# EAGLE design RoverBaseboard (EAGLE 6.4)
DATABASE: /home/mes/eagle/PARTSDB.txt
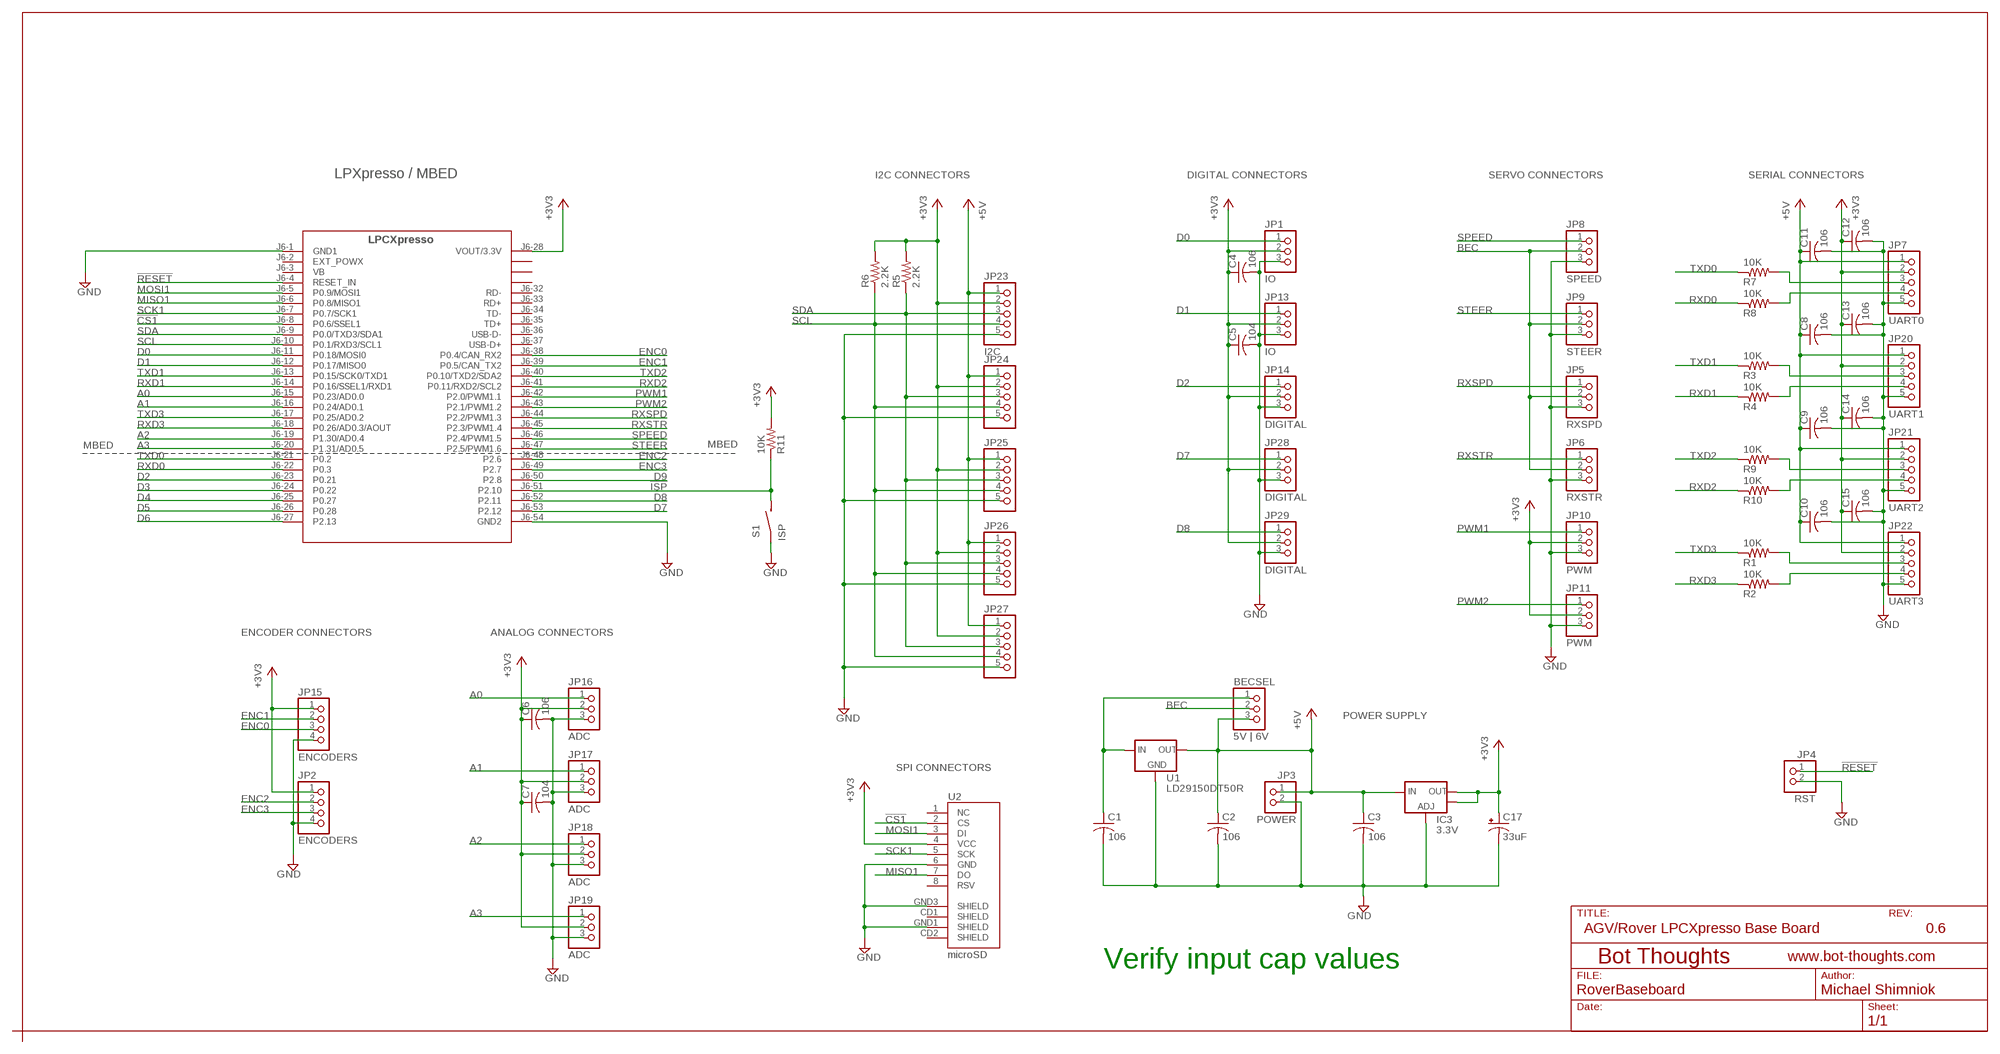
[diagram p0: schematic, sheet 1]

## Parts
BECSEL  5V | 6V  PINHD-1X03_2.54-S  [1X03-S]
C1  106  C-USC1206  [C1206]
C2  106  C-USC1206  [C1206]
C3  106  C-USC1206  [C1206]
C4  106  C-USC0603  [C0603]
C5  104  C-USC0603  [C0603]
C6  106  C-USC0603  [C0603]
C7  104  C-USC0603  [C0603]
C8  106  C-USC0603  [C0603]
C9  106  C-USC0603  [C0603]
C10  106  C-USC0603  [C0603]
C11  106  C-USC0603  [C0603]
C12  106  C-USC0603  [C0603]
C13  106  C-USC0603  [C0603]
C14  106  C-USC0603  [C0603]
C15  106  C-USC0603  [C0603]
C17  33uF  CPOL-US140CLH-0810  [140CLH-0810]
IC3  3.3V  V_REG_LM1117SOT223  [SOT223]
JP1  IO  PINHD-1X03_2.54-S  [1X03-S]
JP2  ENCODERS  PINHD-1X04_2.54-S  [1X04-S]
JP3  POWER  PINHD-1X02_2.54-S  [1X02-S]
JP4  RST  PINHD-1X02_2.54-S  [1X02-S]
JP5  RXSPD  PINHD-1X03_2.54-S  [1X03-S]
JP6  RXSTR  PINHD-1X03_2.54-S  [1X03-S]
JP7  UART0  PINHD-1X05_2.54-S  [1X05-S]
JP8  SPEED  PINHD-1X03_2.54-S  [1X03-S]
JP9  STEER  PINHD-1X03_2.54-S  [1X03-S]
JP10  PWM  PINHD-1X03_2.54-S  [1X03-S]
JP11  PWM  PINHD-1X03_2.54-S  [1X03-S]
JP13  IO  PINHD-1X03_2.54-S  [1X03-S]
JP14  DIGITAL  PINHD-1X03_2.54-S  [1X03-S]
JP15  ENCODERS  PINHD-1X04_2.54-S  [1X04-S]
JP16  ADC  PINHD-1X03_2.54-S  [1X03-S]
JP17  ADC  PINHD-1X03_2.54-S  [1X03-S]
JP18  ADC  PINHD-1X03_2.54-S  [1X03-S]
JP19  ADC  PINHD-1X03_2.54-S  [1X03-S]
JP20  UART1  PINHD-1X05_2.54-S  [1X05-S]
JP21  UART2  PINHD-1X05_2.54-S  [1X05-S]
JP22  UART3  PINHD-1X05_2.54-S  [1X05-S]
JP23  I2C  PINHD-1X05_2.54-S  [1X05-S]
JP24  PINHD-1X05_2.54-S  [1X05-S]
JP25  PINHD-1X05_2.54-S  [1X05-S]
JP26  PINHD-1X05_2.54-S  [1X05-S]
JP27  PINHD-1X05_2.54-S  [1X05-S]
JP28  DIGITAL  PINHD-1X03_2.54-S  [1X03-S]
JP29  DIGITAL  PINHD-1X03_2.54-S  [1X03-S]
R1  10K  R-US_R0603  [R0603]
R2  10K  R-US_R0603  [R0603]
R3  10K  R-US_R0603  [R0603]
R4  10K  R-US_R0603  [R0603]
R5  2.2K  R-US_R0603  [R0603]
R6  2.2K  R-US_R0603  [R0603]
R7  10K  R-US_R0603  [R0603]
R8  10K  R-US_R0603  [R0603]
R9  10K  R-US_R0603  [R0603]
R10  10K  R-US_R0603  [R0603]
R11  10K  R-US_R0603  [R0603]
S1  ISP  SPST_TAC_RECT1  [6MMTACTILE_RECT]
U1  LD29150DT50R  LD29150DT  [DPAK]
U2  microSD  USD-SOCKETNEW  [MICRO-SD-SOCKET-PP]
U$1  LPCXPRESSO  LPCXPRESSO_NO_PAD_1768_REVB  [LPCXPRESSO_NO_PAD]

## Nets
!CS1: U2.2(CS) U$1.J6-8(P0.6/SSEL1)
!ISP: R11.1 S1.P$2(S) U$1.J6-51(P2.10)
!RESET: JP4.1 U$1.J6-4(RESET_IN)
+3V3: C4.1 C5.1 C6.1 C7.1 C12.1 C13.1 C14.1 C15.1 C17.+ IC3.2(OUT) IC3.4(OUT) JP1.2 JP2.1 JP7.2 JP10.2 JP11.2 JP13.2 JP14.2 JP15.1 JP16.2 JP17.2 JP18.2 JP19.2 JP20.2 JP21.2 JP22.2 JP23.2 JP24.2 JP25.2 JP26.2 JP27.2 JP28.2 JP29.2 R5.2 R6.2 R11.2 U2.4(VCC) U$1.J6-28(VOUT/3.3V)
+5V: BECSEL.3 C2.1 C3.1 C8.1 C9.1 C10.1 C11.1 IC3.3(IN) JP3.1 JP7.1 JP20.1 JP21.1 JP22.1 JP23.1 JP24.1 JP25.1 JP26.1 JP27.1 U1.3(VOUT)
A0: JP16.1 U$1.J6-15(P0.23/AD0.0)
A1: JP17.1 U$1.J6-16(P0.24/AD0.1)
A2: JP18.1 U$1.J6-19(P1.30/AD0.4)
A3: JP19.1 U$1.J6-20(P1.31/AD0.5)
BEC: BECSEL.2 JP5.2 JP6.2 JP8.2 JP9.2
D0: JP1.1 U$1.J6-11(P0.18/MOSI0)
D1: JP13.1 U$1.J6-12(P0.17/MISO0)
D2: JP14.1 U$1.J6-23(P0.21)
D3: U$1.J6-24(P0.22)
D4: U$1.J6-25(P0.27)
D5: U$1.J6-26(P0.28)
D6: U$1.J6-27(P2.13)
D7: JP28.1 U$1.J6-53(P2.12)
D8: JP29.1 U$1.J6-52(P2.11)
D9: U$1.J6-50(P2.8)
ENC0: JP15.3 U$1.J6-38(P0.4/CAN_RX2)
ENC1: JP15.2 U$1.J6-39(P0.5/CAN_TX2)
ENC2: JP2.2 U$1.J6-48(P2.6)
ENC3: JP2.3 U$1.J6-49(P2.7)
GND: C1.2 C2.2 C3.2 C4.2 C5.2 C6.2 C7.2 C8.2 C9.2 C10.2 C11.2 C12.2 C13.2 C14.2 C15.2 C17.- IC3.1(ADJ) JP1.3 JP2.4 JP3.2 JP4.2 JP5.3 JP6.3 JP7.5 JP8.3 JP9.3 JP10.3 JP11.3 JP13.3 JP14.3 JP15.4 JP16.3 JP17.3 JP18.3 JP19.3 JP20.5 JP21.5 JP22.5 JP23.5 JP24.5 JP25.5 JP26.5 JP27.5 JP28.3 JP29.3 S1.P$1(P) U1.4(GND) U2.6(GND) U2.GND1(SHIELD) U2.GND3(SHIELD) U$1.J6-1(GND1) U$1.J6-54(GND2)
MISO1: U2.7(DO) U$1.J6-6(P0.8/MISO1)
MOSI1: U2.3(DI) U$1.J6-5(P0.9/MOSI1)
N$1: JP22.3 R1.2
N$2: JP22.4 R2.2
N$6: JP7.3 R7.2
N$7: JP7.4 R8.2
N$9: JP20.3 R3.2
N$10: JP20.4 R4.2
N$16: JP21.3 R9.2
N$17: JP21.4 R10.2
PWM1: JP10.1 U$1.J6-42(P2.0/PWM1.1)
PWM2: JP11.1 U$1.J6-43(P2.1/PWM1.2)
RXD0: R8.1 U$1.J6-22(P0.3)
RXD1: R4.1 U$1.J6-14(P0.16/SSEL1/RXD1)
RXD2: R10.1 U$1.J6-41(P0.11/RXD2/SCL2)
RXD3: R2.1 U$1.J6-18(P0.26/AD0.3/AOUT)
RXSPD: JP5.1 U$1.J6-44(P2.2/PWM1.3)
RXSTR: JP6.1 U$1.J6-45(P2.3/PWM1.4)
SCK1: U2.5(SCK) U$1.J6-7(P0.7/SCK1)
SCL: JP23.4 JP24.4 JP25.4 JP26.4 JP27.4 R6.1 U$1.J6-10(P0.1/RXD3/SCL1)
SDA: JP23.3 JP24.3 JP25.3 JP26.3 JP27.3 R5.1 U$1.J6-9(P0.0/TXD3/SDA1)
SPEED: JP8.1 U$1.J6-46(P2.4/PWM1.5)
STEER: JP9.1 U$1.J6-47(P2.5/PWM1.6)
TXD0: R7.1 U$1.J6-21(P0.2)
TXD1: R3.1 U$1.J6-13(P0.15/SCK0/TXD1)
TXD2: R9.1 U$1.J6-40(P0.10/TXD2/SDA2)
TXD3: R1.1 U$1.J6-17(P0.25/AD0.2)
VBEC: BECSEL.1 C1.1 U1.1(VIN)
Unconnected: U2.1(NC) U2.8(RSV) U2.CD1(SHIELD) U2.CD2(SHIELD) U$1.J6-2(EXT_POWX) U$1.J6-3(VB) U$1.J6-29 U$1.J6-30 U$1.J6-31 U$1.J6-32(RD-) U$1.J6-33(RD+) U$1.J6-34(TD-) U$1.J6-35(TD+) U$1.J6-36(USB-D-) U$1.J6-37(USB-D+)

## Notes on the sheet
- LPXpresso / MBED | I2C CONNECTORS | DIGITAL CONNECTORS | SERVO CONNECTORS | SERIAL CONNECTORS
- MBED | MBED
- ENCODER CONNECTORS | ANALOG CONNECTORS
- POWER SUPPLY
- SPI CONNECTORS
- AGV/Rover LPCXpresso Base Board | 0.6
- Verify input cap values

## Library data of the parts
BECSEL = pinhead-2:PINHD-1X03: PIN HEADER
C1-C15 = rcl:C-US: CAPACITOR, American symbol
C17 = rcl:CPOL-US: POLARIZED CAPACITOR, American symbol
IC3 = SparkFun:V_REG_LM1117: Voltage Regulator LM1117 Standard adjustable voltage regulator but in SMD form. Spark Fun Electronics SKU : COM-00595
JP1 JP5 JP6 JP8-JP11 JP13 JP14 JP16-JP19 JP28 JP29 = pinhead-2:PINHD-1X03: PIN HEADER; OC_NEWARK: unknown
JP2 JP15 = pinhead-2:PINHD-1X04: PIN HEADER; OC_NEWARK: unknown
JP3 JP4 = pinhead-2:PINHD-1X02: PIN HEADER; OC_NEWARK: unknown
JP7 JP20-JP27 = pinhead-2:PINHD-1X05: PIN HEADER
R1-R4 R7-R11 = rcl:R-US_: RESISTOR, American symbol; MPN: WCR0805-220RFI; OC_NEWARK: 98K2621
R5 R6 = rcl:R-US_: RESISTOR, American symbol; OC_NEWARK: unknown
S1 = bt_electromech:SPST: SPST SWITCH
U1 = bt_regulator:LD29150: STM LD29150 LDO Voltage Regulator The LD29150xx is a high current, high accuracy, low-dropout voltage regulator series. These regulators feature 400 mV dropout voltage and very low ground current. Designed for high current loads, these devices are also used in lower current, extremely low dropout-critical systems, where their tiny dropout voltage and ground current values are important attributes. Datasheet.pdf <http://www.st.com/web/en/resource/technical/document/datasheet/CD00003403.pdf>
U2 = SparkFun:USD-SOCKET: microSD Socket Push-push type uSD socket. Schematic element and footprint production proven. Spark Fun Electronics SKU : PRT-00127. tDoc lines correctly indicate media card edge positions when inserting (unlocked, locked, depressed).
U$1 = LPCXpresso:LPCXPRESSO_NO_PAD: NXP LPCXpresso by Embedded Artists LPCXpresso is a new, low-cost development platform available from NXP. It supports NXP's ARM-based LPC microcontrollers. The platform is comprised of a simplified Eclipse-based IDE and low-cost target boards which include an attached JTAG debugger. http://ics.nxp.com/lpcxpresso/ NOTE: This version does NOT include the 37-pin pads on the top of the board

## Board
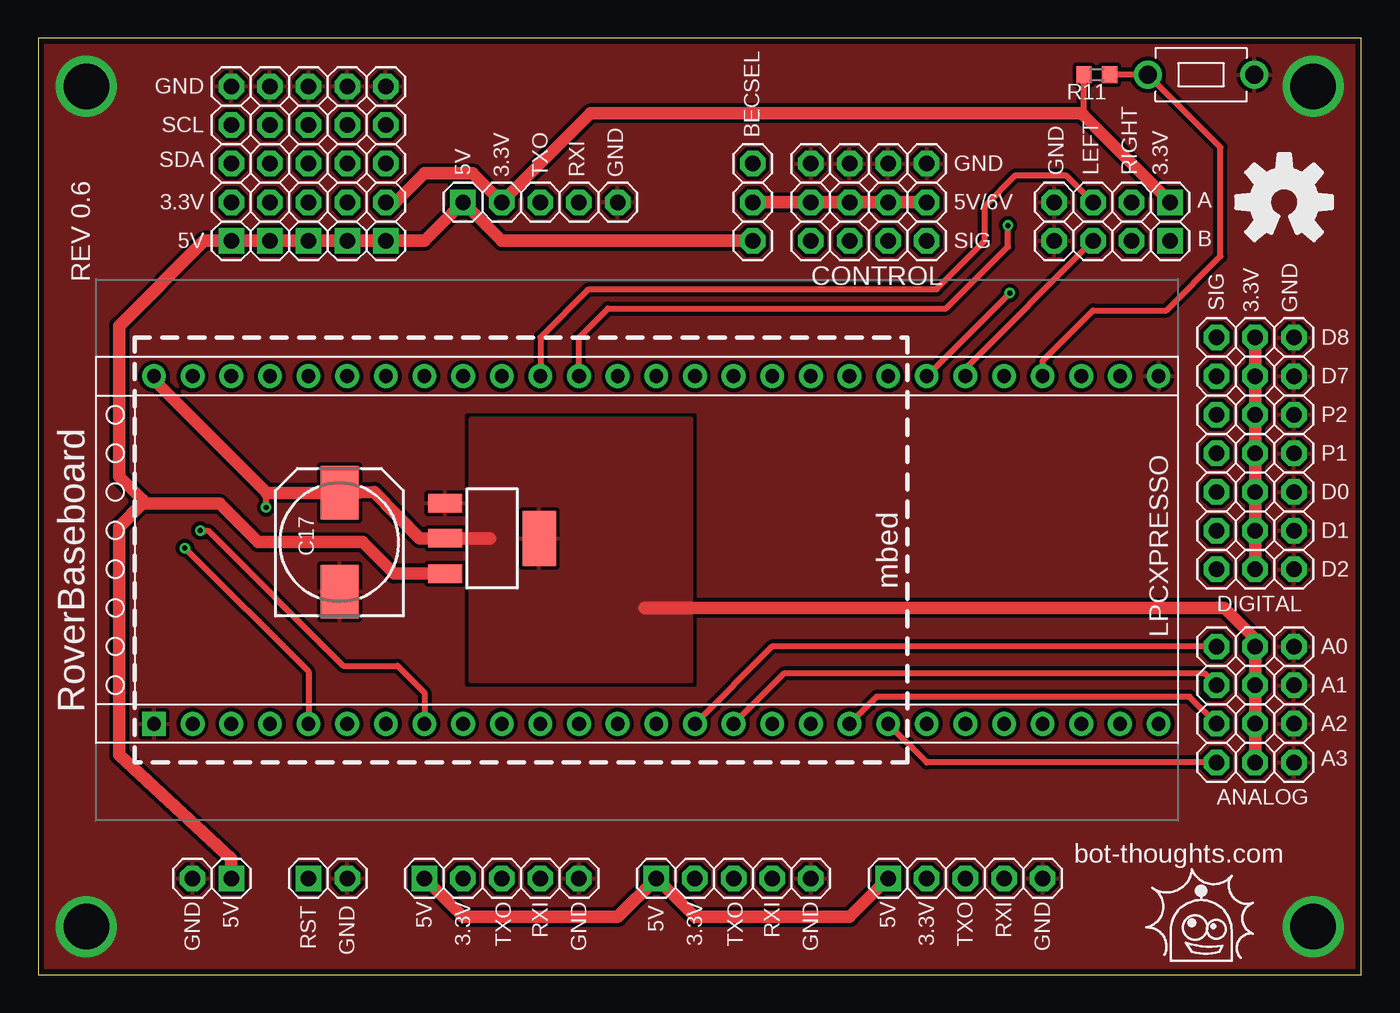
[diagram p1: board, top side]
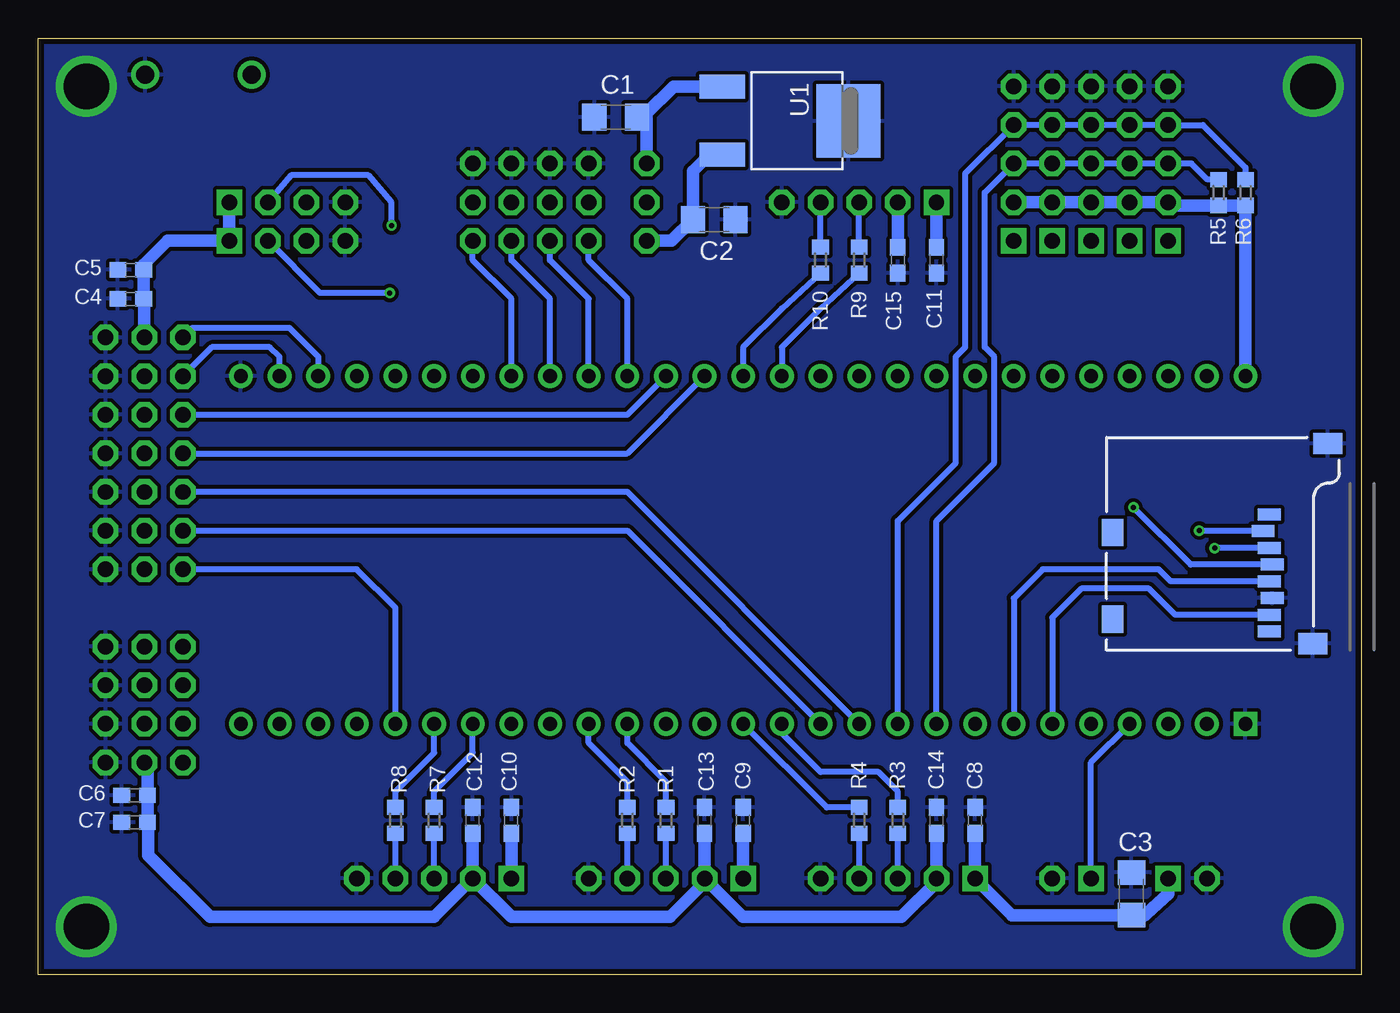
[diagram p2: board, bottom side, seen from below]

Size 87 x 61.59 mm. Coordinates in mm from the lower left corner, seen from the top.
Outline: 0,0 87,0 87,61.59 0,61.59 0,0
Copper layers (1*16): Top 0.0356mm / dielectric 1.5011mm / Bottom 0.0356mm
Design rules "default *": minimum track width 6mil, minimum drill 13mil, track to track 6mil, track to pad 6mil, pad to pad 6mil, via to via 6mil, smd to smd 6mil, copper to edge 15mil, drill to drill 6mil, minimum pad ring 13mil, minimum via ring 7mil, stop-mask expansion 4mil, vias tented up to drill 25mil, thermal gap 10mil

### Footprints (pad centres in the part's own frame; a part is rotated, then mirrored left to right if it is on the bottom)
1X03-S = drill 1.016 octagon: 1 -2.54,0; 2 0,0; 3 2.54,0
C1206 = smd 1.6 x 1.8: 1 -1.4,0; 2 1.4,0
C0603 = smd 1.1 x 1: 1 -0.85,0; 2 0.85,0
140CLH-0810 = smd 3.5 x 2.5: + 3.25,0; - -3.25,0
SOT223 = smd 1.219 x 2.235: 1 -2.311,-3.099; 2 0,-3.099; 3 2.311,-3.099 | smd 3.6 x 2.2: 4 0,3.099
1X04-S = drill 1.016 square: 1 -3.81,0 | drill 1.016 octagon: 2 -1.27,0; 3 1.27,0; 4 3.81,0
1X02-S = drill 1.016 square: 1 -1.27,0 | drill 1.016 octagon: 2 1.27,0
1X05-S = drill 1.016 square: 1 -5.08,0 | drill 1.016 octagon: 2 -2.54,0; 3 0,0; 4 2.54,0; 5 5.08,0
R0603 = smd 1 x 1.1: 1 -0.85,0; 2 0.85,0
6MMTACTILE_RECT = drill 1.2: P$1 -3.5,0; P$2 3.5,0
DPAK = smd 1.6 x 2.997: 1 -2.261,-3.658; 3 2.21,-3.658 | smd 4.826 x 4.191: 4 0,4.623
MICRO-SD-SOCKET-PP = smd 0.8 x 1.5: 1 -8.94,10.7; 2 -7.84,10.3; 3 -6.74,10.7; 4 -5.64,10.9; 5 -4.54,10.7; 6 -3.44,10.9; 7 -2.34,10.7; 8 -1.24,10.7 | smd 1.8 x 1.4: CD1 -2.05,0.4; CD2 -7.75,0.4 | smd 1.4 x 1.9: GND1 -13.6,14.55; GND3 -0.45,13.55
LPCXPRESSO_NO_PAD = drill 0.9 pad 1.422 square: J6-1 -33.02,-11.43 | drill 0.9 pad 1.422: J6-2 -30.48,-11.43; J6-3 -27.94,-11.43; J6-4 -25.4,-11.43; J6-5 -22.86,-11.43; J6-6 -20.32,-11.43; J6-7 -17.78,-11.43; J6-8 -15.24,-11.43; J6-9 -12.7,-11.43; J6-10 -10.16,-11.43; J6-11 -7.62,-11.43; J6-12 -5.08,-11.43; J6-13 -2.54,-11.43; J6-14 0,-11.43; J6-15 2.54,-11.43; J6-16 5.08,-11.43; J6-17 7.62,-11.43; J6-18 10.16,-11.43; J6-19 12.7,-11.43; J6-20 15.24,-11.43; J6-21 17.78,-11.43; J6-22 20.32,-11.43; J6-23 22.86,-11.43; J6-24 25.4,-11.43; J6-25 27.94,-11.43; J6-26 30.48,-11.43; J6-27 33.02,-11.43; J6-28 -33.02,11.43; J6-29 -30.48,11.43; J6-30 -27.94,11.43; J6-31 -25.4,11.43; J6-32 -22.86,11.43; J6-33 -20.32,11.43; J6-34 -17.78,11.43; J6-35 -15.24,11.43; J6-36 -12.7,11.43; J6-37 -10.16,11.43; J6-38 -7.62,11.43; J6-39 -5.08,11.43; J6-40 -2.54,11.43; J6-41 0,11.43; J6-42 2.54,11.43; J6-43 5.08,11.43; J6-44 7.62,11.43; J6-45 10.16,11.43; J6-46 12.7,11.43; J6-47 15.24,11.43; J6-48 17.78,11.43; J6-49 20.32,11.43; J6-50 22.86,11.43; J6-51 25.4,11.43; J6-52 27.94,11.43; J6-53 30.48,11.43; J6-54 33.02,11.43

### Placement (x,y rotation side)
BECSEL  46.99,50.8 270 top
C1  49.02,56.39 180 bottom
C2  42.55,49.66 0 bottom
C3  15.11,5.33 90 bottom
C4  80.9,44.45 180 bottom
C5  80.9,46.35 180 bottom
C6  80.64,11.81 180 bottom
C7  80.64,10.03 180 bottom
C8  25.4,10.16 90 bottom
C9  40.64,10.16 90 bottom
C10  55.88,10.16 90 bottom
C11  27.94,46.99 270 bottom
C12  58.42,10.16 90 bottom
C13  43.18,10.16 90 bottom
C14  27.94,10.16 90 bottom
C15  30.48,46.99 270 bottom
C17  19.81,28.45 90 top
IC3  29.84,28.7 270 top
JP1  80.01,31.75 0 top
JP2  70.61,48.26 180 top
JP3  11.43,6.35 180 top
JP4  19.05,6.35 0 top
JP5  50.8,50.8 90 top
JP6  53.34,50.8 90 top
JP7  60.96,6.35 0 top
JP8  55.88,50.8 90 top
JP9  58.42,50.8 90 top
JP10  80.01,34.29 0 top
JP11  80.01,36.83 0 top
JP13  80.01,29.21 0 top
JP14  80.01,26.67 0 top
JP15  70.61,50.8 180 top
JP16  80.01,21.59 0 top
JP17  80.01,19.05 0 top
JP18  80.01,16.51 0 top
JP19  80.01,13.97 0 top
JP20  30.48,6.35 0 top
JP21  33.02,50.8 0 top
JP22  45.72,6.35 0 top
JP23  12.7,53.34 90 top
JP24  15.24,53.34 90 top
JP25  17.78,53.34 90 top
JP26  20.32,53.34 90 top
JP27  22.86,53.34 90 top
JP28  80.01,39.37 0 top
JP29  80.01,41.91 0 top
R1  45.72,10.16 270 bottom
R2  48.26,10.16 270 bottom
R3  30.48,10.16 270 bottom
R4  33.02,10.16 270 bottom
R5  9.4,51.44 270 bottom
R6  7.62,51.44 270 bottom
R7  60.96,10.16 270 bottom
R8  63.5,10.16 270 bottom
R9  33.02,46.99 90 bottom
R10  35.56,46.99 90 bottom
R11  69.6,59.18 180 top
S1  76.45,59.18 180 top
U1  38.35,56.13 270 bottom
U2  16.76,21.34 270 bottom
U$1  40.64,27.94 0 top

### Tracks (layer width: path | path; a pad name or v marks a point on that pad's centre or on a via)
!CS1  (via drill 0.33)
  Top 0.406: v10.67,29.21 11.18,29.21 20.07,20.32 23.62,20.32 25.4,18.54 U$1.J6-8
  Bottom 0.406: U2.2 10.63,29.18 v10.67,29.21
!ISP
  Top 0.406: R11.1 S1.P$2 77.72,54.41 77.72,47.24 74.17,43.69 69.34,43.69 66.04,40.39 U$1.J6-51
!RESET
  Bottom 0.406: JP4.1 17.78,13.97 U$1.J6-4
+3V3  (via drill 0.33)
  Top 0.406: v14.99,30.73 14.99,31.75 | R11.2 68.71,59.18 68.71,56.52
  Top 0.813: JP27.2 23.5,50.8 25.4,52.7 28.57,52.7 JP21.2 36.32,56.64 68.58,56.64 68.71,56.52 JP15.1 | JP29.2 JP28.2 JP11.2 JP10.2 JP1.2 JP13.2 JP14.2 | JP19.2 JP18.2 JP17.2 JP16.2 80.01,22.1 77.98,24.13 39.88,24.13 | U$1.J6-28 7.62,39.12 14.99,31.75 15.04,31.7 C17.+ 20.37,31.7 22.1,31.75 25.09,28.7 IC3.2 29.72,28.7
  Bottom 0.406: U2.4 11.23,26.98 v14.99,30.73
  Bottom 0.813: JP27.2 JP26.2 JP25.2 JP24.2 JP23.2 12.48,50.59 R5.2 R6.2 U$1.J6-28 | C14.1 JP20.2 27.94,6.1 30.23,3.81 40.64,3.81 JP22.2 | C12.1 JP7.2 | C15.1 JP21.2 | JP29.2 80.01,44.41 C4.1 C5.1 80.05,46.7 78.49,48.26 JP2.1 JP15.1 | JP19.2 79.8,13.76 C6.1 C7.1 79.76,9.99 79.76,7.87 75.69,3.81 60.96,3.81 JP7.2 | C13.1 JP22.2 | JP22.2 43.18,6.1 45.47,3.81 55.88,3.81 JP7.2
  pour Top (isolate 0.254): 28.45,36.58 42.93,36.58 42.93,19.3 28.45,19.3
+5V
  Top 0.813: JP20.1 27.94,3.81 38.1,3.81 JP22.1 43.18,3.81 53.34,3.81 JP7.1 | 6.86,31.24 5.33,32.77 5.33,42.67 10.92,48.26 JP23.1 JP24.1 JP25.1 JP26.1 JP27.1 25.4,48.26 JP21.1 30.48,48.26 BECSEL.3 | 6.86,31.24 7.11,30.99 11.94,30.99 14.48,28.45 21.34,28.45 23.39,26.39 IC3.3 | 6.86,31.24 6.86,30.99 5.33,29.46 5.33,14.48 12.7,7.62 JP3.1
  Bottom 0.813: C8.1 JP20.1 22.98,3.93 C3.1 14.22,3.93 14.09,4.06 12.7,5.33 JP3.1 | C9.1 JP22.1 | C10.1 JP7.1 | C11.1 JP21.1 | U1.3 42.09,53.85 42.93,53.85 43.95,52.83 C2.1 45.34,48.26 BECSEL.3
A0
  Top 0.406: JP16.1 48.26,21.59 U$1.J6-15
A1
  Top 0.406: JP17.1 76.71,19.81 49.02,19.81 U$1.J6-16
A2
  Top 0.406: JP18.1 75.69,18.29 55.12,18.29 U$1.J6-19
A3
  Top 0.406: JP19.1 58.42,13.97 U$1.J6-20
BEC
  Top 0.813: JP9.2 JP8.2 JP6.2 JP5.2 BECSEL.2
D0
  Bottom 0.406: U$1.J6-11 48.26,31.75 JP1.1
D1
  Bottom 0.406: JP13.1 48.26,29.21 U$1.J6-12
D2
  Bottom 0.406: U$1.J6-23 63.5,24.13 66.04,26.67 JP14.1
D7
  Bottom 0.406: U$1.J6-53 71.12,40.64 71.75,41.27 75.56,41.27 JP28.1
D8
  Bottom 0.406: JP29.1 76.83,42.55 70.48,42.55 68.58,40.64 U$1.J6-52
ENC0
  Top 0.406: U$1.J6-38 33.02,41.91 36.2,45.09 59.05,45.09 62.23,48.26 62.23,50.55 64.26,52.58 67.56,52.58 JP15.3
ENC1  (via drill 0.33)
  Top 0.406: U$1.J6-39 35.56,41.91 37.47,43.81 59.69,43.81 63.75,47.88 v63.75,49.28
  Bottom 0.406: v63.75,49.28 63.75,50.8 65.28,52.58 70.36,52.58 JP15.2
ENC2  (via drill 0.33)
  Top 0.406: U$1.J6-48 v63.88,44.83
  Bottom 0.406: v63.88,44.83 68.45,44.83 JP2.2
ENC3
  Top 0.406: U$1.J6-49 60.96,39.88 JP2.3
GND  (via drill 3)
  other vias: 3.17,58.42 83.82,58.42 83.82,3.17 3.17,3.17
  pour Bottom (isolate 0.254, rank 3): 0,61.59 87,61.59 87,0 0,0
  pour Top (isolate 0.254, rank 2): 0,61.59 87,61.59 87,0 0,0
MISO1
  Bottom 0.406: U2.7 12.25,23.68 13.97,25.4 18.41,25.4 20.32,23.5 U$1.J6-6
MOSI1  (via drill 0.33)
  Top 0.406: v9.65,28.07 17.78,19.94 U$1.J6-5
  Bottom 0.406: U2.3 8.37,28.08 v9.65,28.07
N$1
  Bottom 0.406: JP22.3 R1.2
N$2
  Bottom 0.406: JP22.4 R2.2
N$6
  Bottom 0.406: JP7.3 R7.2
N$7
  Bottom 0.406: JP7.4 R8.2
N$9
  Bottom 0.406: JP20.3 R3.2
N$10
  Bottom 0.406: R4.2 JP20.4
N$16
  Bottom 0.406: R9.2 JP21.3
N$17
  Bottom 0.406: R10.2 JP21.4
PWM1
  Bottom 0.406: JP10.1 48.26,34.29 U$1.J6-42
PWM2
  Bottom 0.406: JP11.1 48.26,36.83 U$1.J6-43
RXD0
  Bottom 0.406: R8.1 63.5,12.06 60.96,14.61 U$1.J6-22
RXD1
  Bottom 0.406: R4.1 35.14,11.01 U$1.J6-14
RXD2
  Bottom 0.406: R10.1 38.1,43.81 40.64,41.27 U$1.J6-41
RXD3
  Bottom 0.406: R2.1 48.26,12.7 50.8,15.24 U$1.J6-18
RXSPD
  Bottom 0.406: U$1.J6-44 48.26,44.45 50.8,46.99 JP5.1
RXSTR
  Bottom 0.406: U$1.J6-45 50.8,44.45 53.34,46.99 JP6.1
SCK1
  Bottom 0.406: U2.5 12.54,25.88 13.34,26.67 20.95,26.67 22.86,24.77 U$1.J6-7
SCL
  Bottom 0.406: U$1.J6-10 30.48,29.84 26.67,33.66 26.67,40.64 26.04,41.27 26.04,52.7 JP27.4 JP26.4 JP25.4 JP24.4 JP23.4 10.41,55.88 7.62,53.09 R6.1
SDA
  Bottom 0.406: R5.1 10.12,52.28 11.18,53.34 JP23.3 JP24.3 JP25.3 JP26.3 JP27.3 24.77,51.44 24.77,41.27 24.13,40.64 24.13,33.66 27.94,29.84 U$1.J6-9
SPEED
  Bottom 0.406: U$1.J6-46 53.34,44.45 55.88,46.99 JP8.1
STEER
  Bottom 0.406: U$1.J6-47 55.88,44.45 58.42,46.99 JP9.1
TXD0
  Bottom 0.406: R7.1 60.96,12.06 58.42,14.61 U$1.J6-21
TXD1
  Bottom 0.406: R3.1 30.48,12.06 31.75,13.34 35.56,13.34 38.1,15.88 U$1.J6-13
TXD2
  Bottom 0.406: R9.1 35.56,43.81 38.1,41.27 U$1.J6-40
TXD3
  Bottom 0.406: R1.1 45.72,12.7 48.26,15.24 U$1.J6-17
VBEC
  Bottom 0.813: U1.1 45.24,58.4 46.99,56.64 46.99,56.39 | 46.99,56.39 BECSEL.1 | C1.1 46.99,56.39

### Text on the board
tPlace: mbed
tNames: GND | SCL | SDA | 5V | GND | GND | LEFT | RIGHT | 3.3V | 3.3V | TXO | RXI | GND | 3.3V | 5V/6V | A | 5V | SIG | B | REV 0.6 | CONTROL | SIG | 3.3V | GND | D8 | D7 | P2 | P1 | D0 | D1 | D2 | DIGITAL | A0 | A1 | RoverBaseboard | A2 | A3 | ANALOG | bot-thoughts.com | GND | 5V | RST | GND | 5V | 3.3V | TXO | RXI | GND | 5V | 3.3V | TXO | RXI | GND | 5V | 3.3V | TXO | RXI | GND
tsilk: GND | SCL | 5V | 6V | BECSEL | RXSPD | RXSTR | SPEED | STEER | SDA | 5V | GND | GND | LEFT | RIGHT | 3.3V | REV 0.5 | 3.3V | TXO | RXI | GND | 3.3V | 5V/6V | 5V | UART2 | 7805 | SIG | I2C | CONTROL | ENCODERS | D8 | D7 | P2 | P1 | 3.3V | D0 | C17 | D1 | D2 | mbed | A0 | LPCXPRESSO | A1 | A2 | RoverBaseboard | A3 | SIG | 3.3V | GND | POWER | RST | UART1 | UART3 | UART0 | bot-thoughts.com | GND | 5V | RST | GND | 5V | 3.3V | TXO | RXI | GND | 5V | 3.3V | TXO | RXI | GND | 5V | 3.3V | TXO | RXI | GND
bsilk: C1 | R6 | R5 | C3 | C5 | C11 | C15 | R9 | R10 | C4 | microSD | C6 | C7 | C8 | C14 | R3 | R4 | C9 | C13 | R1 | R2 | C10 | C12 | R7 | R8 | C16 | C2